# Altium schematic sheet DASH_BULKHEAD.SchDoc: =DocumentName
size A4; Organization: Queen's Formula SAE; Address1: 130 Stuart St, Kingston; Address2: Ontario; Address3: Canada; Address4: K7L 2V9; DocumentNumber: 1; Revision: 0; SheetNumber: 1; SheetTotal: 1
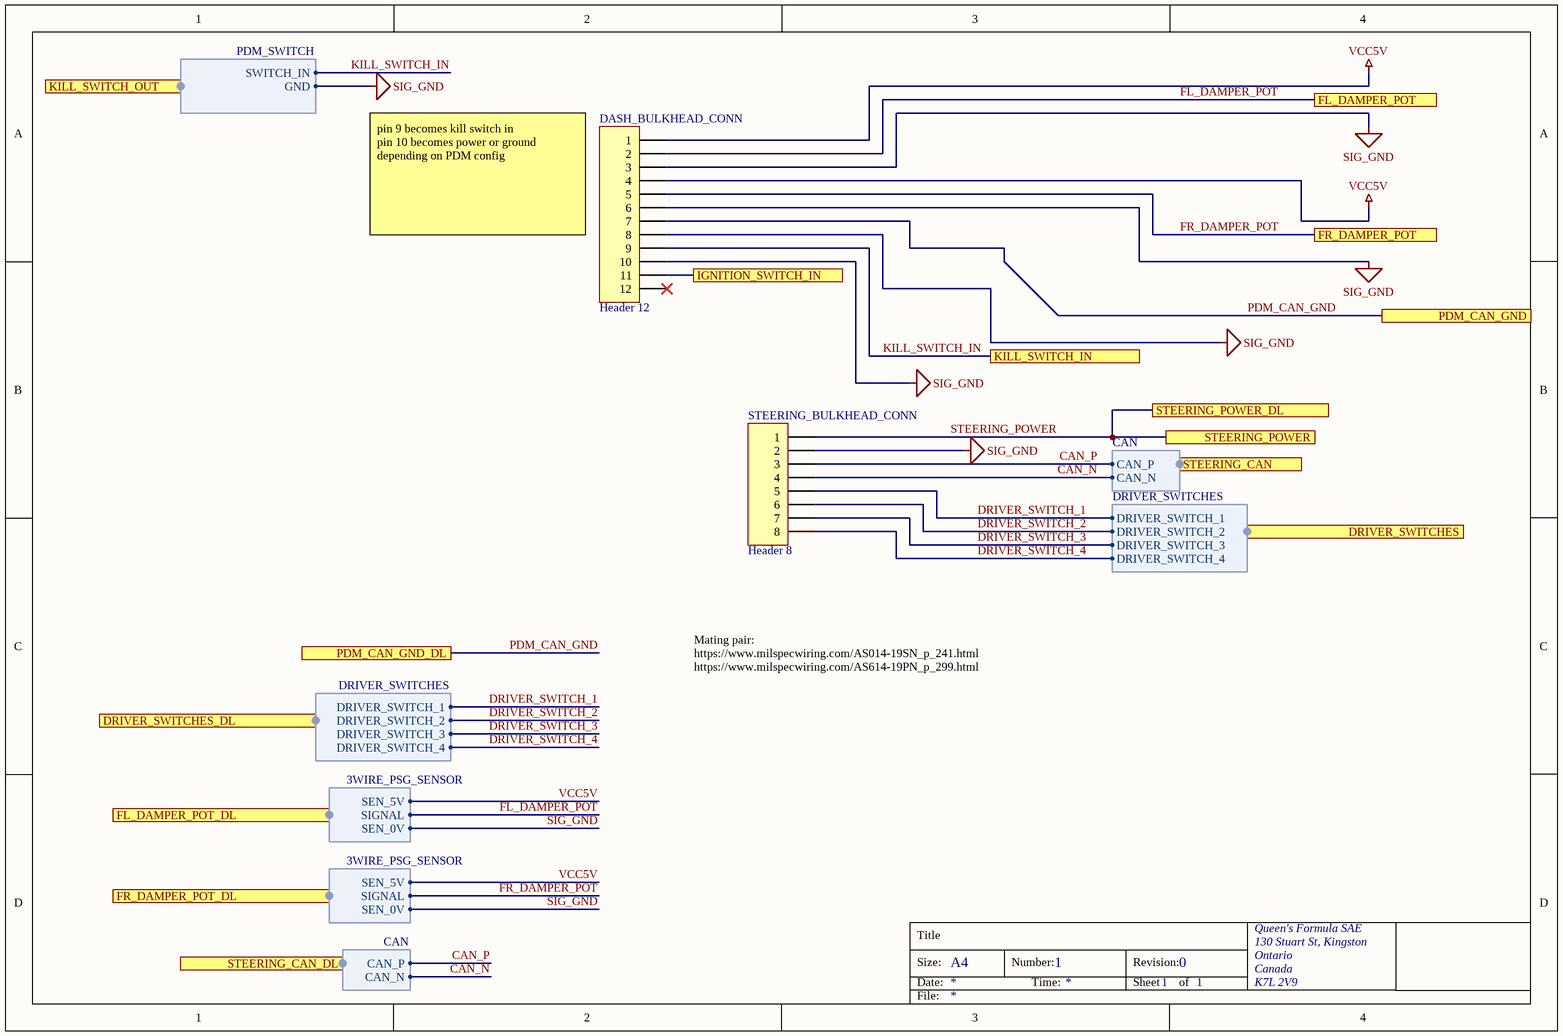
[diagram p0: DASH_BULKHEAD.SchDoc]

## Parts
DASH_BULKHEAD_CONN  Header 12  [HDR1X12]
STEERING_BULKHEAD_CONN  Header 8  [HDR1X8]

## Ports
DRIVER_SWITCHES (harness DRIVER_SWITCHES), DRIVER_SWITCHES_DL (harness DRIVER_SWITCHES), FL_DAMPER_POT, FL_DAMPER_POT_DL (harness 3WIRE_PSG_SENSOR), FR_DAMPER_POT, FR_DAMPER_POT_DL (harness 3WIRE_PSG_SENSOR), IGNITION_SWITCH_IN, KILL_SWITCH_IN, KILL_SWITCH_OUT (harness PDM_SWITCH), PDM_CAN_GND, PDM_CAN_GND_DL, STEERING_CAN (harness CAN), STEERING_CAN_DL (harness CAN), STEERING_POWER, STEERING_POWER_DL

## Harnesses
DRIVER_SWITCHES: DRIVER_SWITCH_1, DRIVER_SWITCH_2, DRIVER_SWITCH_3, DRIVER_SWITCH_4
3WIRE_PSG_SENSOR: SEN_5V, SEN_0V, SIGNAL
CAN: CAN_P, CAN_N
PDM_SWITCH: SWITCH_IN, GND

## Nets
SIG_GND: DASH_BULKHEAD_CONN.3 DASH_BULKHEAD_CONN.6 DASH_BULKHEAD_CONN.8 DASH_BULKHEAD_CONN.10 STEERING_BULKHEAD_CONN.2 ; port FL_DAMPER_POT_DL.SEN_0V, port FR_DAMPER_POT_DL.SEN_0V, port KILL_SWITCH_OUT.GND
VCC5V: DASH_BULKHEAD_CONN.1 DASH_BULKHEAD_CONN.4 ; port FL_DAMPER_POT_DL.SEN_5V, port FR_DAMPER_POT_DL.SEN_5V
CAN_N: STEERING_BULKHEAD_CONN.4 ; port STEERING_CAN_DL.CAN_N, port STEERING_CAN.CAN_N
CAN_P: STEERING_BULKHEAD_CONN.3 ; port STEERING_CAN_DL.CAN_P, port STEERING_CAN.CAN_P
DRIVER_SWITCH_1: STEERING_BULKHEAD_CONN.5 ; port DRIVER_SWITCHES_DL.DRIVER_SWITCH_1, port DRIVER_SWITCHES.DRIVER_SWITCH_1
DRIVER_SWITCH_2: STEERING_BULKHEAD_CONN.6 ; port DRIVER_SWITCHES_DL.DRIVER_SWITCH_2, port DRIVER_SWITCHES.DRIVER_SWITCH_2
DRIVER_SWITCH_3: STEERING_BULKHEAD_CONN.7 ; port DRIVER_SWITCHES_DL.DRIVER_SWITCH_3, port DRIVER_SWITCHES.DRIVER_SWITCH_3
DRIVER_SWITCH_4: STEERING_BULKHEAD_CONN.8 ; port DRIVER_SWITCHES_DL.DRIVER_SWITCH_4, port DRIVER_SWITCHES.DRIVER_SWITCH_4
FL_DAMPER_POT: DASH_BULKHEAD_CONN.2 ; port FL_DAMPER_POT, port FL_DAMPER_POT_DL.SIGNAL
FR_DAMPER_POT: DASH_BULKHEAD_CONN.5 ; port FR_DAMPER_POT, port FR_DAMPER_POT_DL.SIGNAL
IGNITION_SWITCH_IN: DASH_BULKHEAD_CONN.11 ; port IGNITION_SWITCH_IN
KILL_SWITCH_IN: DASH_BULKHEAD_CONN.9 ; port KILL_SWITCH_IN, port KILL_SWITCH_OUT.SWITCH_IN
PDM_CAN_GND: DASH_BULKHEAD_CONN.7 ; port PDM_CAN_GND_DL, port PDM_CAN_GND
STEERING_POWER: STEERING_BULKHEAD_CONN.1 ; port STEERING_POWER, port STEERING_POWER_DL

Not connected (* = marked no-connect by the designer): DASH_BULKHEAD_CONN 12*

## Notes on the sheet
- pin 9 becomes kill switch in
  pin 10 becomes power or ground depending on PDM config
- Mating pair:
  https://www.milspecwiring.com/AS014-19SN_p_241.html
  https://www.milspecwiring.com/AS614-19PN_p_299.html
- Title
- Size:
- Date:
- A4
- Number:
- Time:
- Revision:
- Sheet
- of
- File:

## Library data of the parts
DASH_BULKHEAD_CONN = Header 12: Header, 12-Pin; LatestRevisionDate: 17-Jul-2002; LatestRevisionNote: Re-released for DXP Platform.; Publisher: Altium Limited
STEERING_BULKHEAD_CONN = Header 8: Header, 8-Pin; LatestRevisionDate: 17-Jul-2002; LatestRevisionNote: Re-released for DXP Platform.; Publisher: Altium Limited